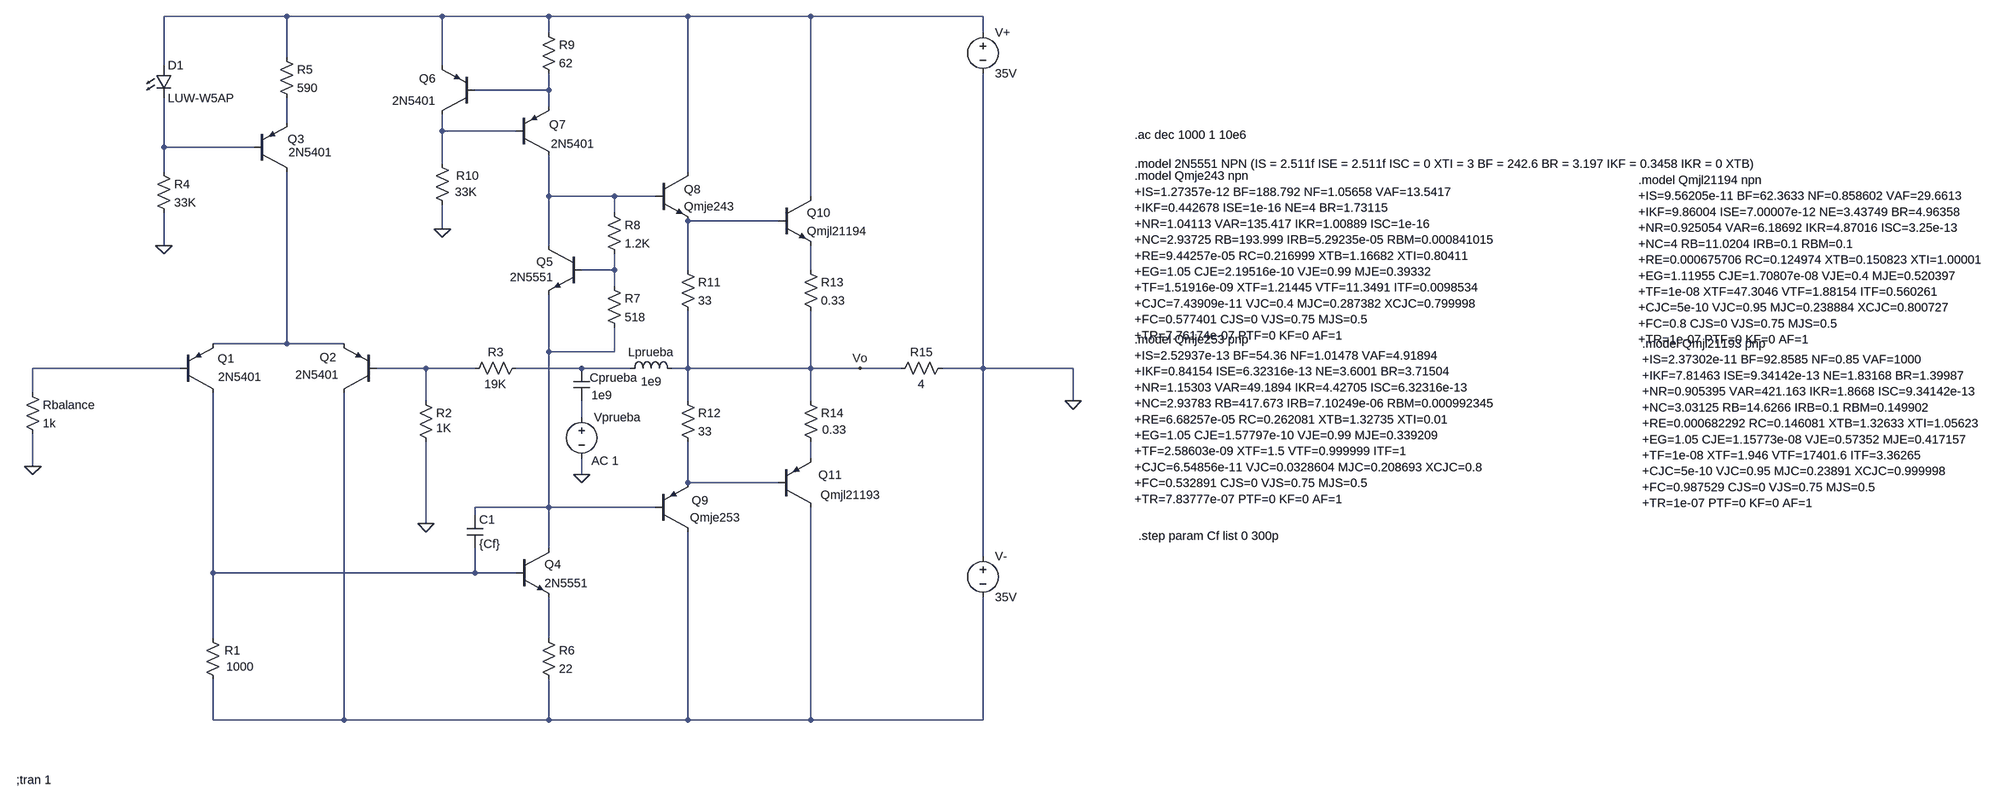
[diagram p0: schematic Ejercicio_5_GL_compensado.asc]
Ejercicio_5_GL_compensado.asc, the LTspice schematic file:
Version 4
SHEET 1 6632 680
WIRE -3440 -2016 -3680 -2016
WIRE -3136 -2016 -3440 -2016
WIRE -2928 -2016 -3136 -2016
WIRE -2656 -2016 -2928 -2016
WIRE -2416 -2016 -2656 -2016
WIRE -2080 -2016 -2416 -2016
WIRE -2928 -1984 -2928 -2016
WIRE -2080 -1984 -2080 -2016
WIRE -3440 -1936 -3440 -2016
WIRE -3680 -1920 -3680 -2016
WIRE -3136 -1920 -3136 -2016
WIRE -2928 -1872 -2928 -1904
WIRE -2928 -1872 -3072 -1872
WIRE -2928 -1840 -2928 -1872
WIRE -3440 -1808 -3440 -1856
WIRE -3136 -1792 -3136 -1824
WIRE -2992 -1792 -3136 -1792
WIRE -3680 -1760 -3680 -1856
WIRE -3504 -1760 -3680 -1760
WIRE -3136 -1728 -3136 -1792
WIRE -3680 -1712 -3680 -1760
WIRE -2656 -1712 -2656 -2016
WIRE -2928 -1664 -2928 -1744
WIRE -2800 -1664 -2928 -1664
WIRE -2720 -1664 -2800 -1664
WIRE -2416 -1664 -2416 -2016
WIRE -2800 -1632 -2800 -1664
WIRE -2480 -1616 -2656 -1616
WIRE -3136 -1600 -3136 -1648
WIRE -3680 -1568 -3680 -1632
WIRE -2928 -1568 -2928 -1664
WIRE -2800 -1520 -2800 -1552
WIRE -2800 -1520 -2864 -1520
WIRE -2656 -1520 -2656 -1616
WIRE -2416 -1520 -2416 -1568
WIRE -2800 -1488 -2800 -1520
WIRE -3440 -1376 -3440 -1712
WIRE -3440 -1376 -3584 -1376
WIRE -3328 -1376 -3440 -1376
WIRE -2928 -1360 -2928 -1472
WIRE -2800 -1360 -2800 -1408
WIRE -2800 -1360 -2928 -1360
WIRE -3648 -1328 -3936 -1328
WIRE -3168 -1328 -3264 -1328
WIRE -3072 -1328 -3168 -1328
WIRE -2864 -1328 -2992 -1328
WIRE -2768 -1328 -2864 -1328
WIRE -2656 -1328 -2656 -1440
WIRE -2656 -1328 -2688 -1328
WIRE -2416 -1328 -2416 -1440
WIRE -2416 -1328 -2656 -1328
WIRE -2320 -1328 -2416 -1328
WIRE -2240 -1328 -2320 -1328
WIRE -2080 -1328 -2080 -1904
WIRE -2080 -1328 -2160 -1328
WIRE -1904 -1328 -2080 -1328
WIRE -3936 -1280 -3936 -1328
WIRE -3168 -1264 -3168 -1328
WIRE -2656 -1264 -2656 -1328
WIRE -2416 -1264 -2416 -1328
WIRE -1904 -1264 -1904 -1328
WIRE -2864 -1232 -2864 -1264
WIRE -2416 -1152 -2416 -1184
WIRE -3936 -1136 -3936 -1200
WIRE -2864 -1120 -2864 -1152
WIRE -2656 -1104 -2656 -1184
WIRE -2480 -1104 -2656 -1104
WIRE -2928 -1056 -2928 -1360
WIRE -2928 -1056 -3072 -1056
WIRE -2720 -1056 -2928 -1056
WIRE -3072 -1040 -3072 -1056
WIRE -3168 -1024 -3168 -1184
WIRE -2928 -976 -2928 -1056
WIRE -2080 -960 -2080 -1328
WIRE -3584 -928 -3584 -1280
WIRE -3072 -928 -3072 -976
WIRE -3072 -928 -3584 -928
WIRE -2992 -928 -3072 -928
WIRE -3584 -800 -3584 -928
WIRE -2928 -800 -2928 -880
WIRE -3584 -640 -3584 -720
WIRE -3328 -640 -3328 -1280
WIRE -3328 -640 -3584 -640
WIRE -2928 -640 -2928 -720
WIRE -2928 -640 -3328 -640
WIRE -2656 -640 -2656 -1008
WIRE -2656 -640 -2928 -640
WIRE -2416 -640 -2416 -1056
WIRE -2416 -640 -2656 -640
WIRE -2080 -640 -2080 -880
WIRE -2080 -640 -2416 -640
FLAG -3936 -1136 0
FLAG -1904 -1264 0
FLAG -2320 -1328 Vo
FLAG -3680 -1568 0
FLAG -3136 -1600 0
FLAG -3168 -1024 0
FLAG -2864 -1120 0
SYMBOL npn -2480 -1664 R0
SYMATTR InstName Q10
SYMATTR Value Qmjl21194
SYMBOL npn -2720 -1712 R0
WINDOW 0 56 34 Left 2
SYMATTR InstName Q8
SYMATTR Value Qmje243
SYMBOL npn -2992 -976 R0
SYMATTR InstName Q4
SYMATTR Value 2N5551
SYMBOL pnp -3504 -1712 M180
WINDOW 0 66 64 Left 2
WINDOW 3 68 38 Left 2
SYMATTR InstName Q3
SYMATTR Value 2N5401
SYMBOL pnp -2720 -1008 M180
WINDOW 0 71 61 Left 2
WINDOW 3 68 28 Left 2
SYMATTR InstName Q9
SYMATTR Value Qmje253
SYMBOL pnp -2480 -1056 M180
WINDOW 0 79 63 Left 2
WINDOW 3 83 24 Left 2
SYMATTR InstName Q11
SYMATTR Value Qmjl21193
SYMBOL pnp -3648 -1280 M180
WINDOW 0 73 67 Left 2
WINDOW 3 74 31 Left 2
SYMATTR InstName Q1
SYMATTR Value 2N5401
SYMBOL npn -2864 -1568 M0
WINDOW 3 55 62 Left 2
SYMATTR Value 2N5551
SYMATTR InstName Q5
SYMBOL res -2432 -1536 R0
SYMATTR InstName R13
SYMATTR Value 0.33
SYMBOL res -2432 -1280 R0
WINDOW 3 38 72 Left 2
SYMATTR Value 0.33
SYMATTR InstName R14
SYMBOL res -2672 -1536 R0
SYMATTR InstName R11
SYMATTR Value 33
SYMBOL res -2144 -1344 R90
WINDOW 0 0 56 VBottom 2
WINDOW 3 32 56 VTop 2
SYMATTR InstName R15
SYMATTR Value 4
SYMBOL res -2816 -1648 R0
SYMATTR InstName R8
SYMATTR Value 1.2K
SYMBOL res -2816 -1504 R0
SYMATTR InstName R7
SYMATTR Value 518
SYMBOL res -3184 -1280 R0
WINDOW 3 36 69 Left 2
SYMATTR Value 1K
SYMATTR InstName R2
SYMBOL res -3456 -1952 R0
SYMATTR InstName R5
SYMATTR Value 590
SYMBOL res -3600 -816 R0
WINDOW 0 39 40 Left 2
WINDOW 3 42 72 Left 2
SYMATTR InstName R1
SYMATTR Value 1000
SYMBOL res -3696 -1728 R0
SYMATTR InstName R4
SYMATTR Value 33K
SYMBOL voltage -2080 -2000 R0
SYMATTR InstName V+
SYMATTR Value 35V
SYMBOL voltage -2080 -976 R0
SYMATTR InstName V-
SYMATTR Value 35V
SYMBOL LED -3696 -1920 R0
SYMATTR InstName D1
SYMATTR Value LUW-W5AP
SYMBOL pnp -3264 -1280 R180
WINDOW 0 79 69 Left 2
WINDOW 3 74 35 Left 2
SYMATTR InstName Q2
SYMATTR Value 2N5401
SYMBOL pnp -3072 -1824 R180
WINDOW 0 77 70 Left 2
WINDOW 3 77 27 Left 2
SYMATTR InstName Q6
SYMATTR Value 2N5401
SYMBOL res -3152 -1744 R0
WINDOW 0 43 40 Left 2
WINDOW 3 41 71 Left 2
SYMATTR InstName R10
SYMATTR Value 33K
SYMBOL pnp -2992 -1744 M180
WINDOW 0 65 60 Left 2
WINDOW 3 68 23 Left 2
SYMATTR InstName Q7
SYMATTR Value 2N5401
SYMBOL res -2944 -2000 R0
SYMATTR InstName R9
SYMATTR Value 62
SYMBOL res -2944 -816 R0
SYMATTR InstName R6
SYMATTR Value 22
SYMBOL res -2976 -1344 R90
WINDOW 0 0 56 VBottom 2
WINDOW 3 32 56 VTop 2
SYMATTR InstName R3
SYMATTR Value 19K
SYMBOL cap -3088 -1040 R0
SYMATTR InstName C1
SYMATTR Value {Cf}
SYMBOL res -2672 -1280 R0
SYMATTR InstName R12
SYMATTR Value 33
SYMBOL voltage -2864 -1248 R0
WINDOW 3 19 101 Left 2
SYMATTR Value AC 1
SYMATTR InstName Vprueba
SYMBOL ind -2672 -1312 M270
WINDOW 0 32 56 VTop 2
WINDOW 3 5 56 VBottom 2
SYMATTR InstName Lprueba
SYMATTR Value 1e9
SYMBOL cap -2880 -1328 R0
WINDOW 0 32 19 Left 2
WINDOW 3 35 53 Left 2
SYMATTR InstName Cprueba
SYMATTR Value 1e9
SYMBOL res -3952 -1296 R0
SYMATTR InstName Rbalance
SYMATTR Value 1k
TEXT -3968 192 Left 2 !;tran 1
TEXT -1584 -1728 Left 2 !.model 2N5551 NPN (IS = 2.511f ISE = 2.511f ISC = 0 XTI = 3 BF = 242.6 BR = 3.197 IKF = 0.3458 IKR = 0 XTB)
TEXT -1584 -1704 Left 2 !.model Qmje243 npn\n+IS=1.27357e-12 BF=188.792 NF=1.05658 VAF=13.5417\n+IKF=0.442678 ISE=1e-16 NE=4 BR=1.73115\n+NR=1.04113 VAR=135.417 IKR=1.00889 ISC=1e-16\n+NC=2.93725 RB=193.999 IRB=5.29235e-05 RBM=0.000841015\n+RE=9.44257e-05 RC=0.216999 XTB=1.16682 XTI=0.80411\n+EG=1.05 CJE=2.19516e-10 VJE=0.99 MJE=0.39332\n+TF=1.51916e-09 XTF=1.21445 VTF=11.3491 ITF=0.0098534\n+CJC=7.43909e-11 VJC=0.4 MJC=0.287382 XCJC=0.799998\n+FC=0.577401 CJS=0 VJS=0.75 MJS=0.5\n+TR=7.76174e-07 PTF=0 KF=0 AF=1
TEXT -1584 -1384 Left 2 !.model Qmje253 pnp\n+IS=2.52937e-13 BF=54.36 NF=1.01478 VAF=4.91894\n+IKF=0.84154 ISE=6.32316e-13 NE=3.6001 BR=3.71504\n+NR=1.15303 VAR=49.1894 IKR=4.42705 ISC=6.32316e-13\n+NC=2.93783 RB=417.673 IRB=7.10249e-06 RBM=0.000992345\n+RE=6.68257e-05 RC=0.262081 XTB=1.32735 XTI=0.01\n+EG=1.05 CJE=1.57797e-10 VJE=0.99 MJE=0.339209\n+TF=2.58603e-09 XTF=1.5 VTF=0.999999 ITF=1\n+CJC=6.54856e-11 VJC=0.0328604 MJC=0.208693 XCJC=0.8\n+FC=0.532891 CJS=0 VJS=0.75 MJS=0.5\n+TR=7.83777e-07 PTF=0 KF=0 AF=1
TEXT -600 -1696 Left 2 !.model Qmjl21194 npn\n+IS=9.56205e-11 BF=62.3633 NF=0.858602 VAF=29.6613\n+IKF=9.86004 ISE=7.00007e-12 NE=3.43749 BR=4.96358\n+NR=0.925054 VAR=6.18692 IKR=4.87016 ISC=3.25e-13\n+NC=4 RB=11.0204 IRB=0.1 RBM=0.1\n+RE=0.000675706 RC=0.124974 XTB=0.150823 XTI=1.00001\n+EG=1.11955 CJE=1.70807e-08 VJE=0.4 MJE=0.520397\n+TF=1e-08 XTF=47.3046 VTF=1.88154 ITF=0.560261\n+CJC=5e-10 VJC=0.95 MJC=0.238884 XCJC=0.800727\n+FC=0.8 CJS=0 VJS=0.75 MJS=0.5\n+TR=1e-07 PTF=0 KF=0 AF=1
TEXT -592 -1376 Left 2 !.model Qmjl21193 pnp\n+IS=2.37302e-11 BF=92.8585 NF=0.85 VAF=1000\n+IKF=7.81463 ISE=9.34142e-13 NE=1.83168 BR=1.39987\n+NR=0.905395 VAR=421.163 IKR=1.8668 ISC=9.34142e-13\n+NC=3.03125 RB=14.6266 IRB=0.1 RBM=0.149902\n+RE=0.000682292 RC=0.146081 XTB=1.32633 XTI=1.05623\n+EG=1.05 CJE=1.15773e-08 VJE=0.57352 MJE=0.417157\n+TF=1e-08 XTF=1.946 VTF=17401.6 ITF=3.36265\n+CJC=5e-10 VJC=0.95 MJC=0.23891 XCJC=0.999998\n+FC=0.987529 CJS=0 VJS=0.75 MJS=0.5\n+TR=1e-07 PTF=0 KF=0 AF=1
TEXT -1584 -1784 Left 2 !.ac dec 1000 1 10e6
TEXT -1576 -1000 Left 2 !.step param Cf list 0 300p

The netlist it stands for:
* Ejercicio_5_GL_compensado.asc
Q10 N001 N007 N009 0 Qmjl21194
Q8 N001 N006 N007 0 Qmje243
Q4 N011 N018 N019 0 2N5551
Q3 N010 N005 N003 0 2N5401
Q9 N020 N011 N017 0 Qmje253
Q11 N020 N017 N016 0 Qmjl21193
Q1 N018 N012 N010 0 2N5401
Q5 N006 N008 N011 0 2N5551
R13 N009 Vo 0.33
R14 Vo N016 0.33
R11 N007 Vo 33
R15 0 Vo 4
R8 N006 N008 1.2K
R7 N008 N011 518
R2 N013 0 1K
R5 N001 N003 590
R1 N018 N020 1000
R4 N005 0 33K
V+ N001 0 35V
V- 0 N020 35V
D1 N001 N005 LUW-W5AP
Q2 N020 N013 N010 0 2N5401
Q6 N004 N002 N001 0 2N5401
R10 N004 0 33K
Q7 N006 N004 N002 0 2N5401
R9 N001 N002 62
R6 N019 N020 22
R3 N014 N013 19K
C1 N011 N018 {Cf}
R12 Vo N017 33
Vprueba N015 0 AC 1
Lprueba Vo N014 1e9
Cprueba N014 N015 1e9
Rbalance N012 0 1k
.model D D
.lib standard.dio
.model NPN NPN
.model PNP PNP
.lib standard.bjt
;tran 1
.model 2N5551 NPN (IS = 2.511f ISE = 2.511f ISC = 0 XTI = 3 BF = 242.6 BR = 3.197 IKF = 0.3458 IKR = 0 XTB)
.model Qmje243 npn
+IS=1.27357e-12 BF=188.792 NF=1.05658 VAF=13.5417
+IKF=0.442678 ISE=1e-16 NE=4 BR=1.73115
+NR=1.04113 VAR=135.417 IKR=1.00889 ISC=1e-16
+NC=2.93725 RB=193.999 IRB=5.29235e-05 RBM=0.000841015
+RE=9.44257e-05 RC=0.216999 XTB=1.16682 XTI=0.80411
+EG=1.05 CJE=2.19516e-10 VJE=0.99 MJE=0.39332
+TF=1.51916e-09 XTF=1.21445 VTF=11.3491 ITF=0.0098534
+CJC=7.43909e-11 VJC=0.4 MJC=0.287382 XCJC=0.799998
+FC=0.577401 CJS=0 VJS=0.75 MJS=0.5
+TR=7.76174e-07 PTF=0 KF=0 AF=1
.model Qmje253 pnp
+IS=2.52937e-13 BF=54.36 NF=1.01478 VAF=4.91894
+IKF=0.84154 ISE=6.32316e-13 NE=3.6001 BR=3.71504
+NR=1.15303 VAR=49.1894 IKR=4.42705 ISC=6.32316e-13
+NC=2.93783 RB=417.673 IRB=7.10249e-06 RBM=0.000992345
+RE=6.68257e-05 RC=0.262081 XTB=1.32735 XTI=0.01
+EG=1.05 CJE=1.57797e-10 VJE=0.99 MJE=0.339209
+TF=2.58603e-09 XTF=1.5 VTF=0.999999 ITF=1
+CJC=6.54856e-11 VJC=0.0328604 MJC=0.208693 XCJC=0.8
+FC=0.532891 CJS=0 VJS=0.75 MJS=0.5
+TR=7.83777e-07 PTF=0 KF=0 AF=1
.model Qmjl21194 npn
+IS=9.56205e-11 BF=62.3633 NF=0.858602 VAF=29.6613
+IKF=9.86004 ISE=7.00007e-12 NE=3.43749 BR=4.96358
+NR=0.925054 VAR=6.18692 IKR=4.87016 ISC=3.25e-13
+NC=4 RB=11.0204 IRB=0.1 RBM=0.1
+RE=0.000675706 RC=0.124974 XTB=0.150823 XTI=1.00001
+EG=1.11955 CJE=1.70807e-08 VJE=0.4 MJE=0.520397
+TF=1e-08 XTF=47.3046 VTF=1.88154 ITF=0.560261
+CJC=5e-10 VJC=0.95 MJC=0.238884 XCJC=0.800727
+FC=0.8 CJS=0 VJS=0.75 MJS=0.5
+TR=1e-07 PTF=0 KF=0 AF=1
.model Qmjl21193 pnp
+IS=2.37302e-11 BF=92.8585 NF=0.85 VAF=1000
+IKF=7.81463 ISE=9.34142e-13 NE=1.83168 BR=1.39987
+NR=0.905395 VAR=421.163 IKR=1.8668 ISC=9.34142e-13
+NC=3.03125 RB=14.6266 IRB=0.1 RBM=0.149902
+RE=0.000682292 RC=0.146081 XTB=1.32633 XTI=1.05623
+EG=1.05 CJE=1.15773e-08 VJE=0.57352 MJE=0.417157
+TF=1e-08 XTF=1.946 VTF=17401.6 ITF=3.36265
+CJC=5e-10 VJC=0.95 MJC=0.23891 XCJC=0.999998
+FC=0.987529 CJS=0 VJS=0.75 MJS=0.5
+TR=1e-07 PTF=0 KF=0 AF=1
.ac dec 1000 1 10e6
.step param Cf list 0 300p
.backanno
.end